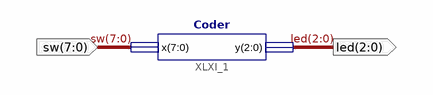
[diagram p0: schematic sheet 1]
// Xilinx ISE schematic Scheme.sch (spartan6) as structural Verilog: 1 symbols, 2 ports
module Scheme (
  input  [7:0] sw,
  output [2:0] led
);

  Coder XLXI_1 (.x(sw), .y(led));
endmodule
